# EAGLE design wx_station (EAGLE 4.16)
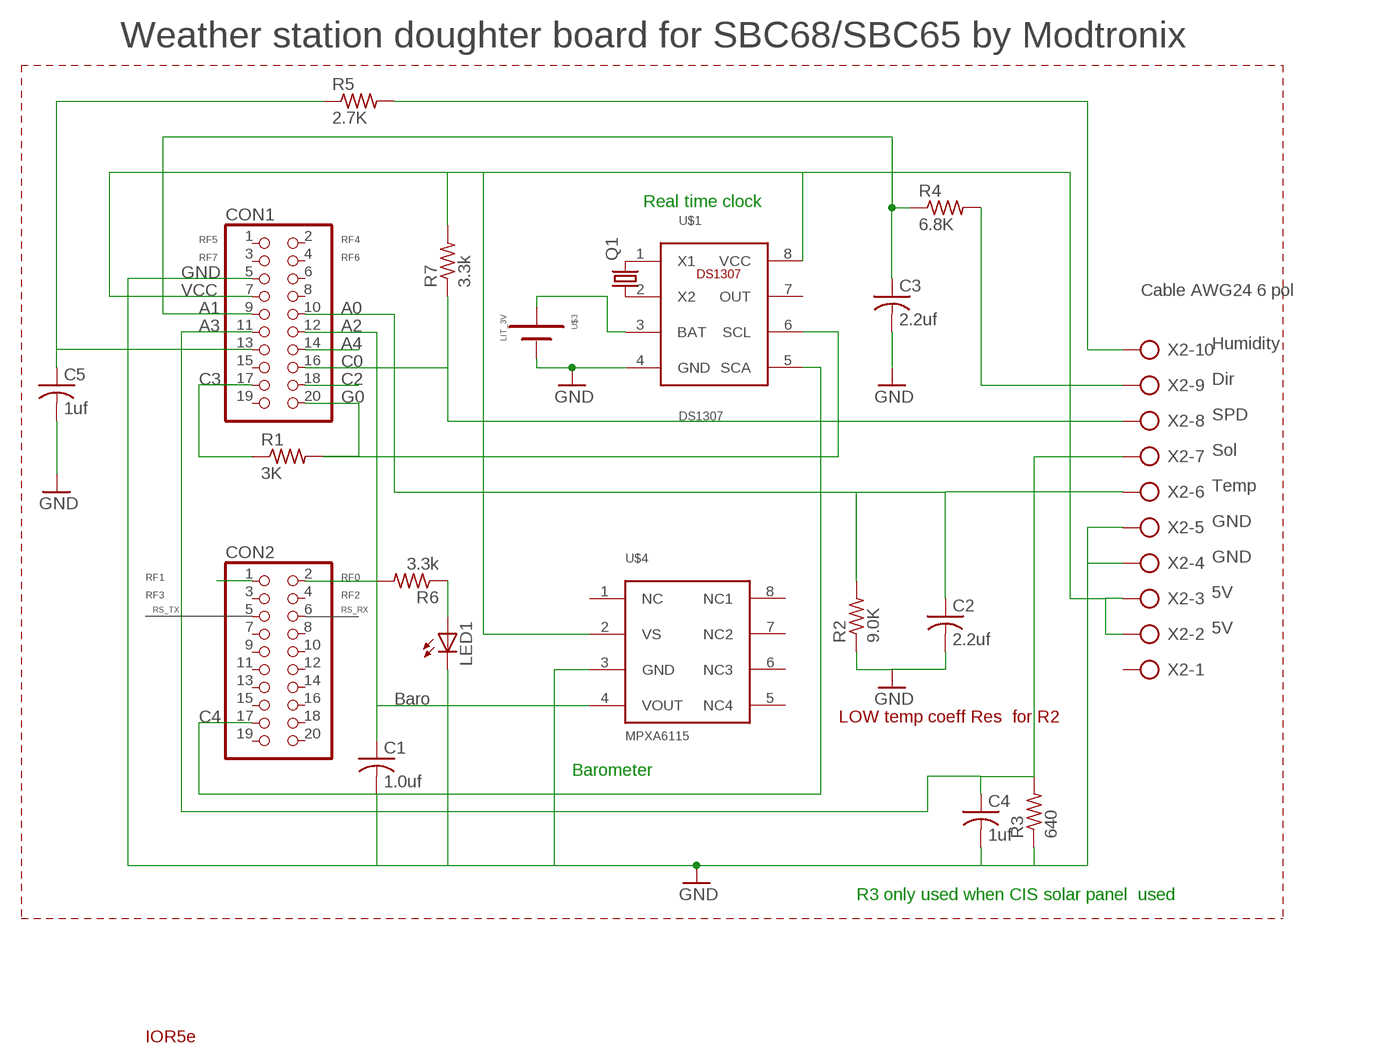
[diagram p0: schematic, sheet 1]

## Parts
C1  1.0uf  C-USC0805  [C0805]
C2  2.2uf  C-USC0805K  [C0805K]
C3  2.2uf  C-USC1206  [C1206]
C4  1uf  C-USC0805  [C0805]
C5  1uf  C-USC0805  [C0805]
CON1  PINHD-2X10  [2X10]
CON2  PINHD-2X10  [2X10]
LED1  LED3MM  [LED3MM]
Q1  CRYSTALTC26H  [TC26H]
R1  3K  R-US_M0805  [M0805]
R2  9.0K  R-US_0207/10  [0207/10]
R3  640  R-US_0207/10  [0207/10]
R4  6.8K  R-US_0207/10  [0207/10]
R5  2.7K  R-US_0207/10  [0207/10]
R6  3.3k  R-US_0207/10  [0207/10]
R7  3.3k  R-US_0207/10  [0207/10]
U$1  DS1307  [DIL08]
U$3  LIT_3V  [BATTERY2]
U$4  MPXA6115  [SO08]
U$7  IOR5E  [IOR5E]
X2  AK500/10  [AK500/10]

## Nets
BARO_OUT: C1.1 CON1.12 U$4.4(VOUT)
BAT: U$1.3(BAT) U$3.PLUS
GND: C1.2 C2.2 C3.2 C4.2 C5.2 CON1.5 LED1.K(C) R2.1 R3.1 U$1.4(GND) U$3.MINUS U$4.3(GND) X2.4 X2.5
N$1: Q1.2 U$1.1(X1)
N$2: Q1.1 U$1.2(X2)
N$3: CON1.17 R1.1
N$4: CON1.20 R1.2 U$1.6(SCL)
N$5: CON2.17 U$1.5(SCA)
N$6: C5.1 CON1.13 R5.1
N$8: CON2.2 R6.2
N$11: C3.1 CON1.9 R4.1
N$15: CON1.14
N$17: LED1.A R6.1
N$18: CON1.18
PIN_1_2: CON2.1
SIG_DIR: R4.2 X2.9
SIG_HUMIDITY: R5.2 X2.10
SIG_SOL: C4.1 CON1.11 R3.2 X2.7
SIG_SPD: CON1.16 R7.1 X2.8
SIG_TEMP: C2.1 CON1.10 R2.2 X2.6
VCC: CON1.7 R7.2 U$1.8(VCC) U$4.2(VS) X2.2 X2.3
Unconnected: CON1.1 CON1.2 CON1.3 CON1.4 CON1.6 CON1.8 CON1.15 CON1.19 CON2.3 CON2.4 CON2.5 CON2.6 CON2.7 CON2.8 CON2.9 CON2.10 CON2.11 CON2.12 CON2.13 CON2.14 CON2.15 CON2.16 CON2.18 CON2.19 CON2.20 U$1.7(OUT) U$4.1(NC) U$4.5(NC4) U$4.6(NC3) U$4.7(NC2) U$4.8(NC1) X2.1

## Notes on the sheet
- Weather station doughter board for SBC68/SBC65 by Modtronix
- Real time clock
- RF5 | RF4
- RF7 | RF6
- GND
- VCC | Cable AWG24 6 pol
- A1 | A0
- A3 | A2
- A4 | Humidity
- C0
- C3 | C2 | Dir
- G0
- SPD
- Sol
- Temp
- GND
- GND
- RF1 | RF0
- RF3 | RF2 | 5V
- RS_TX | RS_RX
- 5V
- Baro
- C4 | LOW temp coeff Res  for R2
- Barometer
- R3 only used when CIS solar panel  used

## Library data of the parts
C1-C5 = rcl:C-US: CAPACITOR, American symbol
CON1 CON2 = pinhead:PINHD-2X10: PIN HEADER
LED1 = led:LED: LED OSRAM: - CHIPLED LG R971, LG N971, LY N971, LG Q971, LY Q971, LO R971, LY R971 LH N974, LH R974 LS Q976, LO Q976, LY Q976 LO Q996 - Hyper CHIPLED LW Q18S LB Q993, LB Q99A, LB R99A - SideLED LS A670, LO A670, LY A670, LG A670, LP A670 LB A673, LV A673, LT A673, LW A673 LH A674 LY A675 LS A676, LA A676, LO A676, LY A676, LW A676 LS A679, LY A679, LG A679 - Hyper Micro SIDELED® LS Y876, LA Y876, LO Y876, LY Y876 LT Y87S - SmartLED LW L88C, LW L88S LB L89C, LB L89S, LG L890 LS L89K, LO L89K, LY L89K LS L896, LA L896, LO L896, LY L896 - TOPLED LS T670, LO T670, LY T670, LG T670, LP T670 LSG T670, LSP T670, LSY T670, LOP T670, LYG T670 LG T671, LOG T671, LSG T671 LB T673, LV T673, LT T673, LW T673 LH T674 LS T676, LA T676, LO T676, LY T676, LB T676, LH T676, LSB T676, LW T676 LB T67C, LV T67C, LT T67C, LS T67K, LO T67K, LY T67K, LW E67C LS E67B, LA E67B, LO E67B, LY E67B, LB E67C, LV E67C, LT E67C LW T67C LS T679, LY T679, LG T679 LS T770, LO T770, LY T770, LG T770, LP T770 LB T773, LV T773, LT T773, LW T773 LH T774 LS E675, LA E675, LY E675, LS T675 LS T776, LA T776, LO T776, LY T776, LB T776 LHGB T686 LT T68C, LB T68C - Hyper Mini TOPLED® LB M676 - Mini TOPLED Santana® LG M470 LS M47K, LO M47K, LY M47K Source: http://www.osram.convergy.de - LUMILED® LXK2-PW12-R00, LXK2-PW12-S00, LXK2-PW14-U00, LXK2-PW14-V00 LXK2-PM12-R00, LXK2-PM12-S00, LXK2-PM14-U00 LXK2-PE12-Q00, LXK2-PE12-R00, LXK2-PE12-S00, LXK2-PE14-T00, LXK2-PE14-U00 LXK2-PB12-K00, LXK2-PB12-L00, LXK2-PB12-M00, LXK2-PB14-N00, LXK2-PB14-P00, LXK2-PB14-Q00 LXK2-PR12-L00, LXK2-PR12-M00, LXK2-PR14-Q00, LXK2-PR14-R00 LXK2-PD12-Q00, LXK2-PD12-R00, LXK2-PD12-S00 LXK2-PH12-R00, LXK2-PH12-S00 LXK2-PL12-P00, LXK2-PL12-Q00, LXK2-PL12-R00 Source: www.luxeon.com
Q1 = crystal:CRYSTAL: CRYSTAL
R1-R7 = rcl:R-US_: RESISTOR, American symbol
U$1 = maxim:DS1307
U$3 = special:LIT_3V: Lithium 3V battery cell holder,2pin
U$4 = Stofer:MPXA6115
U$7 = PCB-Outlines:IOR5E
X2 = con-ptr500:AK500/10: CONNECTOR

## Board
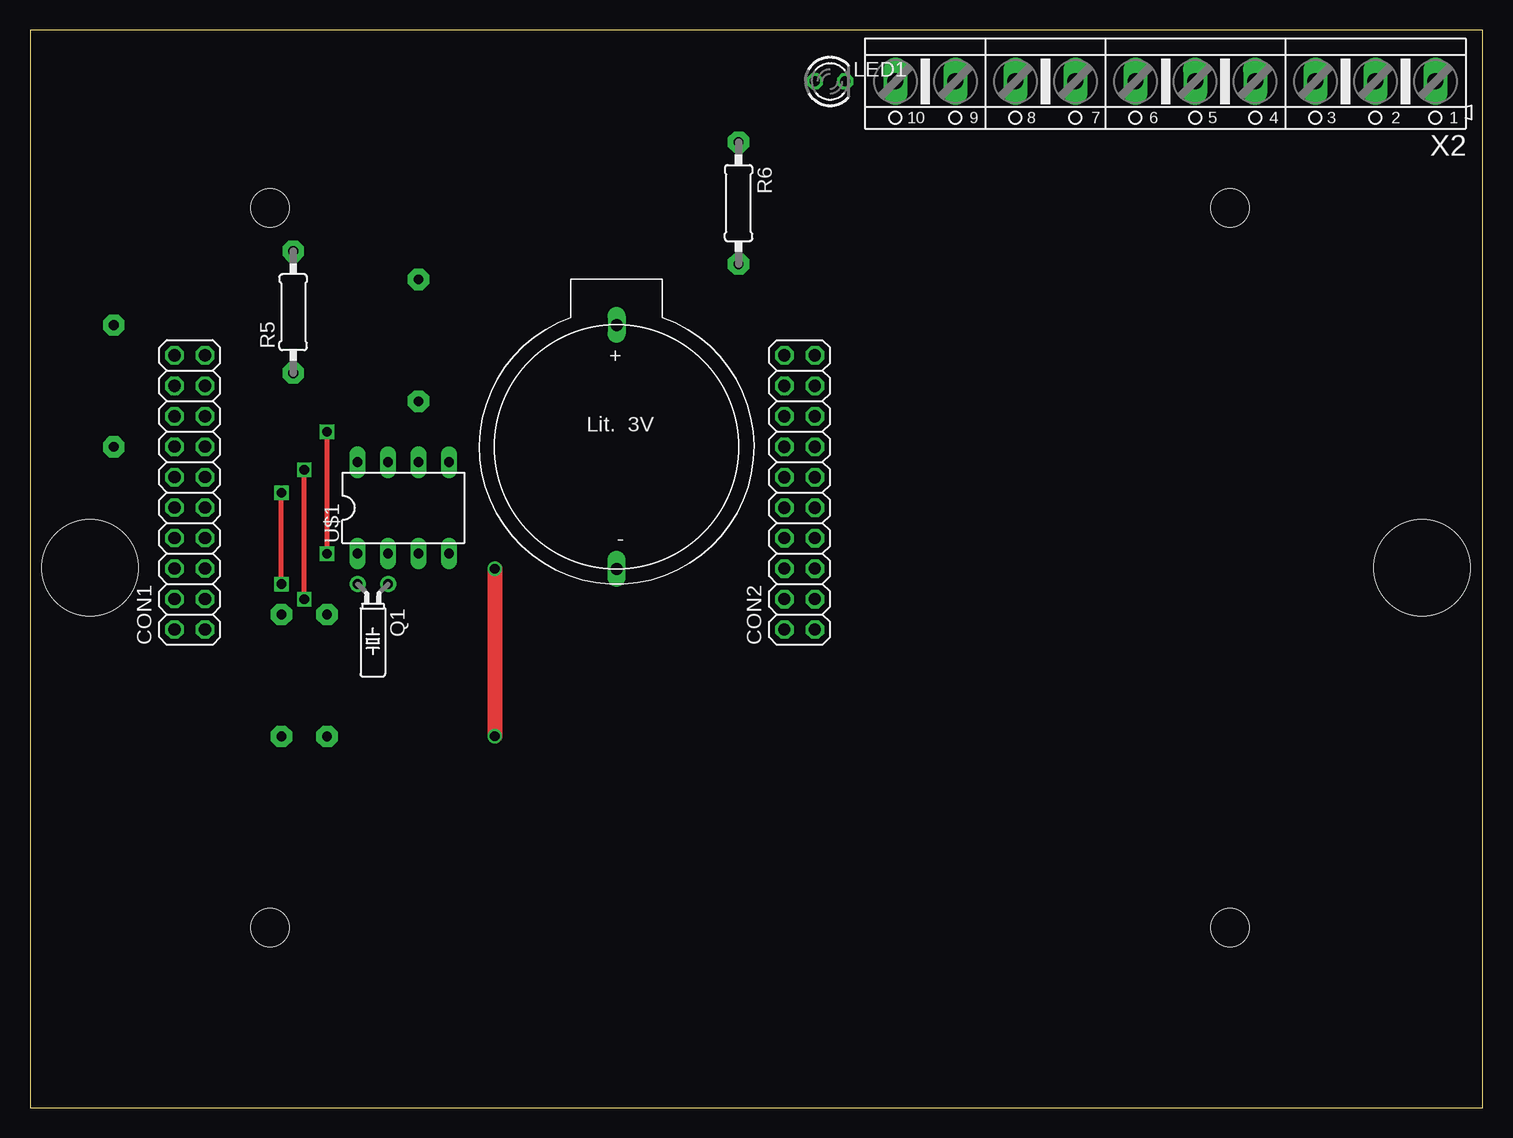
[diagram p1: board, top side]
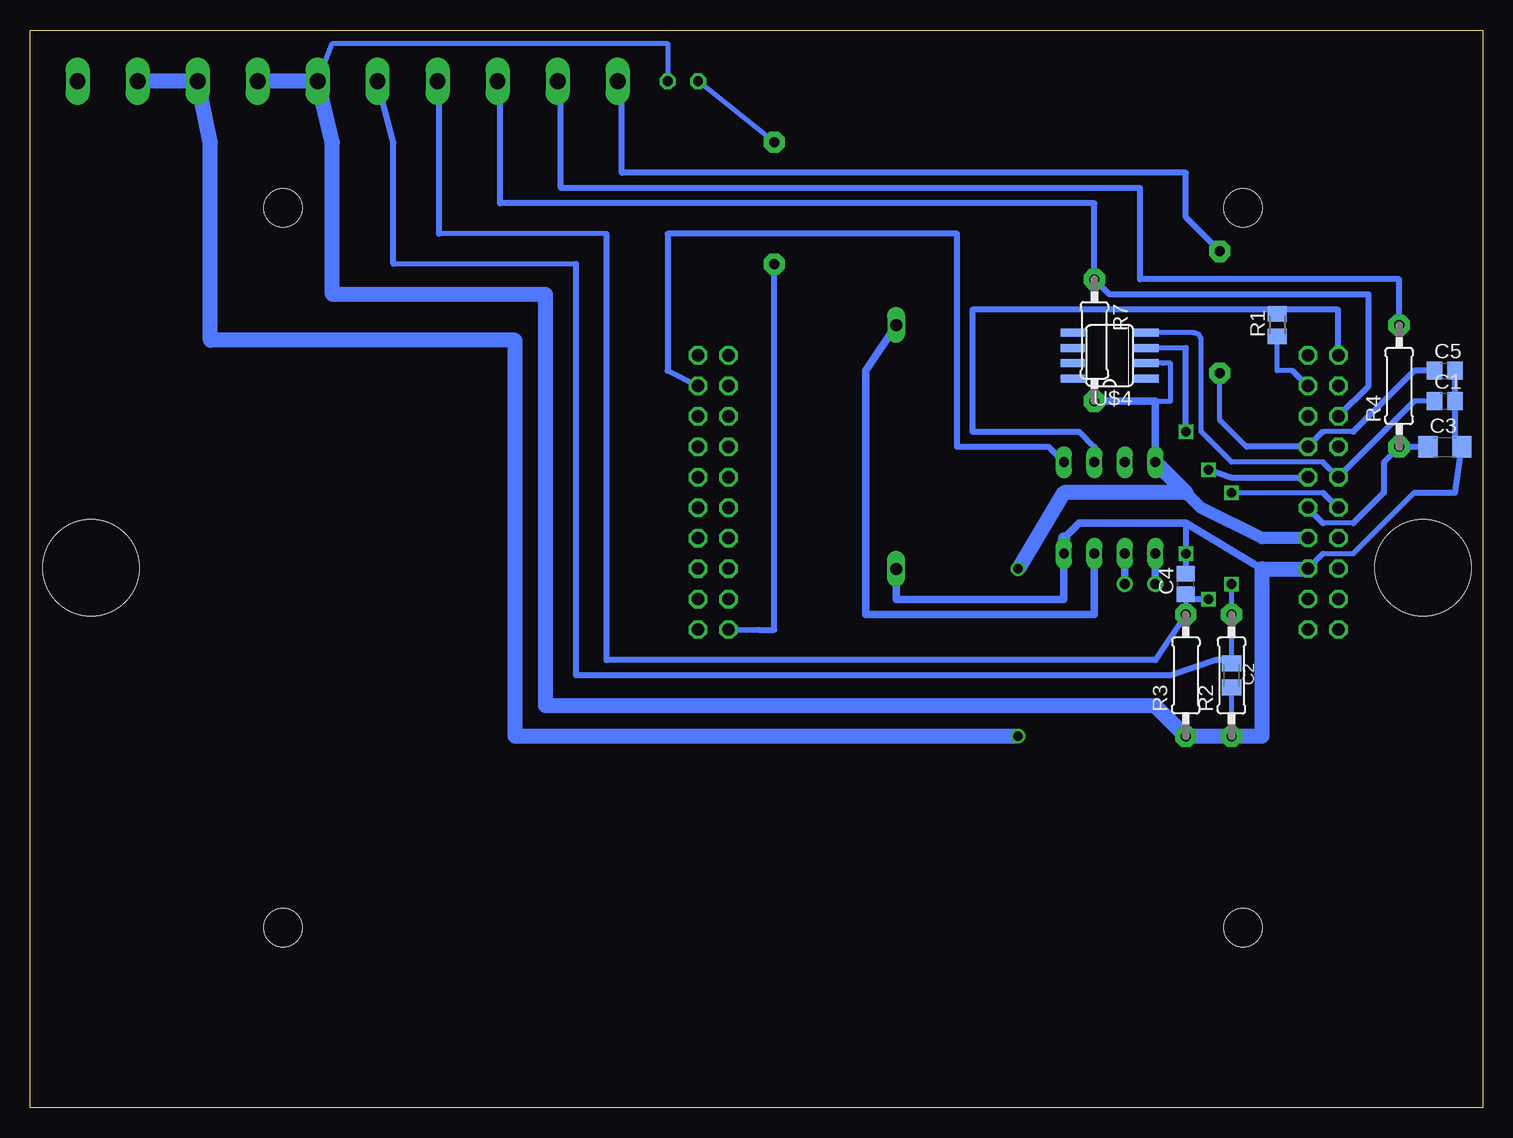
[diagram p2: board, bottom side, seen from below]

Size 121.08 x 89.86 mm. Coordinates in mm from the lower left corner, seen from the top.
Outline: 0,0.02 121.08,0 121.08,89.84 0,89.86 0,0.02
Copper layers (1*2+15*16): Top 0.035mm / dielectric 0.2mm / Route2 0.035mm / dielectric 0.15mm / Route15 0.035mm / dielectric 0.2mm / Bottom 0.035mm
Design rules "default": minimum track width 10mil, minimum drill 24mil, track to track 8mil, track to pad 8mil, pad to pad 8mil, via to via 8mil, smd to smd 8mil, copper to edge 40mil, drill to drill 8mil, minimum pad ring 10mil, minimum via ring 8mil, stop-mask expansion 4mil, vias tented up to drill 0mil, thermal gap 10mil

### Footprints (pad centres in the part's own frame; a part is rotated, then mirrored left to right if it is on the bottom)
C0805 = smd 1.3 x 1.5: 1 -0.85,0; 2 0.85,0
C0805K = smd 1.3 x 1.6: 1 -1,0; 2 1,0
C1206 = smd 1.6 x 1.8: 1 -1.4,0; 2 1.4,0
2X10 = drill 1.016 octagon: 1 -11.43,-1.27; 2 -11.43,1.27; 3 -8.89,-1.27; 4 -8.89,1.27; 5 -6.35,-1.27; 6 -6.35,1.27; 7 -3.81,-1.27; 8 -3.81,1.27; 9 -1.27,-1.27; 10 -1.27,1.27; 11 1.27,-1.27; 12 1.27,1.27; 13 3.81,-1.27; 14 3.81,1.27; 15 6.35,-1.27; 16 6.35,1.27; 17 8.89,-1.27; 18 8.89,1.27; 19 11.43,-1.27; 20 11.43,1.27
LED3MM = drill 0.813 octagon: A -1.27,0; K 1.27,0
TC26H = drill 0.813 round: 1 -1.27,0; 2 1.27,0
M0805 = smd 1.3 x 1.6: 1 -0.95,0; 2 0.95,0
0207/10 = drill 0.813 pad 1.778 octagon: 1 -5.08,0; 2 5.08,0
DIL08 = drill 0.813 long: 1 -3.81,-3.81; 2 -1.27,-3.81; 3 1.27,-3.81; 4 3.81,-3.81; 5 3.81,3.81; 6 1.27,3.81; 7 -1.27,3.81; 8 -3.81,3.81
BATTERY2 = drill 1 long: MINUS 0,-10.16; PLUS 0,10.16
SO08 = smd 0.66 x 2.032: 1 -1.905,-3.073; 2 -0.635,-3.073; 3 0.635,-3.073; 4 1.905,-3.073; 5 1.905,3.073; 6 0.635,3.073; 7 -0.635,3.073; 8 -1.905,3.073
IOR5E = hole 3.2: 20,15; 20,75; 100,15; 100,75 | hole 8: 5,45; 116,45
AK500/10 = drill 1.321 long: 1 -22.504,0; 2 -17.501,0; 3 -12.497,0; 4 -7.493,0; 5 -2.489,0; 6 2.489,0; 7 7.493,0; 8 12.497,0; 9 17.501,0; 10 22.504,0

### Placement (x,y rotation side)
C1  3.17,58.91 0 bottom
C2  20.95,36.05 270 bottom
C3  3.17,55.1 0 bottom
C4  24.76,43.67 90 bottom
C5  3.17,61.45 0 bottom
CON1  13.31,51.31 90 top
CON2  64.14,51.3 90 top
LED1  66.67,85.58 0 top
Q1  28.57,43.67 180 top
R1  17.14,65.26 90 bottom
R2  20.95,36.05 90 bottom
R3  24.76,36.05 90 bottom
R4  6.98,60.18 90 bottom
R5  21.93,66.33 90 top
R6  59.05,75.42 270 top
R7  32.38,63.99 270 bottom
U$1  31.11,50.02 0 top
U$3  48.89,55.1 0 top
U$4  31.11,62.72 90 bottom
U$7  0,0.03 0 top
X2  94.61,85.58 180 top

### Tracks (layer width: path | path; a pad name or v marks a point on that pad's centre or on a via)
BARO_OUT
  Bottom 0.406: 13.33,53.83 20.95,53.83 23.49,56.37 23.49,63.99 arc-90 24.12,64.63 U$4.4 | C1.1 5.71,58.91 | CON1.12
  Bottom 0.508: CON1.12 13.33,53.83 | 5.71,58.91 CON1.12
BAT
  Bottom 0.61: U$1.3 32.38,41.13 51.43,41.13 51.43,61.45 U$3.PLUS
GND  (via drill 0.8)
  Top 0.406: v24.76,46.21 v24.76,56.37
  Bottom 0.406: 13.33,46.21 10.79,46.21 5.71,51.29 | 14.6,44.94 CON1.5 | R2.1 C2.2 | 24.76,63.36 U$4.3 | C3.2 1.9,55.1 arc90 2.32,55.52 | C1.2 1.9,58.91 | X2.5 95.88,88.76 67.94,88.76 LED1.K
  Bottom 0.508: 14.6,44.94 13.33,46.21 | 5.71,51.29 2.32,51.29 C3.2 | v24.76,56.37 24.76,63.36 | 24.76,48.75 v24.76,46.21 C4.2 | 2.32,55.52 C1.2 C5.2
  Bottom 0.61: 34.92,47.48 33.65,48.75 24.76,48.75 18.41,44.94 | U$1.4 34.92,42.4 48.89,42.4 U$3.MINUS
  Bottom 1.016: 34.92,47.48 U$1.4
  Bottom 1.27: 14.6,44.94 18.41,44.94 18.41,30.97 R2.1 R3.1 27.3,33.51 78.1,33.51 78.1,67.8 95.88,67.8 95.88,80.5 X2.5 X2.4
N$1
  Bottom 0.61: Q1.2 U$1.1
N$2
  Bottom 0.61: Q1.1 U$1.2
N$3
  Bottom 0.406: R1.1 17.14,61.45 15.87,61.45 | 14.6,60.18 CON1.17
  Bottom 0.508: 14.6,60.18 15.87,61.45
N$4
  Bottom 0.406: 12.06,62.72 CON1.20 | 17.14,66.53 R1.2
  Bottom 0.508: U$1.6 32.38,55.1 33.65,56.37 42.54,56.37 42.54,66.53 17.14,66.53 12.06,66.53 12.06,62.72
N$5
  Bottom 0.406: CON2.17
  Bottom 0.508: CON2.17 67.94,61.45 67.94,72.88 43.81,72.88 43.81,55.1 36.19,55.1 U$1.5
N$6
  Bottom 0.406: CON1.13 | 10.79,56.37 13.33,56.37 | 5.71,61.45 4.44,61.45 | 19.68,55.12 19.68,55.1 21.93,57.35 R5.1
  Bottom 0.508: 13.33,56.37 CON1.13 | 10.79,56.37 5.71,61.45 C5.1 | CON1.13 19.68,55.12
N$8
  Bottom 0.508: CON2.2 60.32,39.86 59.05,39.86 R6.2
N$9  (via drill 1.3)
  other vias: 4.99,45.04
N$10  (via drill 1.3)
  other vias: 116,45.04
N$11
  Bottom 0.406: 14.58,50 CON1.9 | 10.79,48.75 13.33,48.75
  Bottom 0.508: 13.33,48.75 14.58,50 | 10.79,48.75 8.25,51.29 8.25,53.83 R4.1 C3.1
N$12  (via drill 1.3)
  other vias: 100.01,75.02
N$13  (via drill 1.3)
  other vias: 100,15.02
N$14  (via drill 1.3)
  other vias: 20,15.04
N$16  (via drill 1.3)
  other vias: 20,75.03
N$17
  Bottom 0.406: R6.1 LED1.A
SIG_DIR
  Bottom 0.508: R4.2 6.98,69.07 28.57,69.07 28.57,76.69 76.83,76.69 76.83,85.58 X2.9
SIG_HUMIDITY
  Bottom 0.508: R5.2 24.76,74.24 24.76,77.96 71.75,77.96 71.75,85.58 X2.10
SIG_SOL  (via drill 0.8)
  Top 0.406: v22.86,42.4 v22.86,53.2
  Bottom 0.406: 14.6,52.56 CON1.11 | 73.02,72.88 86.99,72.88 | C4.1 24.76,42.4 R3.2
  Bottom 0.508: v22.86,53.2 20.95,52.56 14.6,52.56 | 73.02,72.88 73.02,37.32 27.3,37.32 R3.2 | v22.86,42.4 24.76,42.4 | X2.7 86.99,85.58 86.99,72.88
SIG_SPD
  Bottom 0.406: 12.06,57.64 CON1.16
  Bottom 0.508: CON1.16 9.52,60.18 9.52,67.8 31.11,67.8 R7.1 32.38,75.42 81.91,75.42 81.91,85.58 X2.8
SIG_TEMP  (via drill 0.8)
  Top 0.406: v20.95,43.67 v20.95,51.29
  Bottom 0.406: 12.08,50.04 CON1.10 | v20.95,51.29 13.33,51.29 | 75.56,70.34 90.8,70.34 | v20.95,43.67 R2.2 20.95,37.32 C2.1
  Bottom 0.508: 13.33,51.29 12.08,50.04 | 75.56,70.34 75.56,36.05 26.03,36.05 22.22,37.32 20.95,37.32 | 90.8,70.34 90.8,80.5 X2.6
VCC  (via drill 0.8 pad 1.02)
  Top 1.27: v38.73,44.94 v38.73,30.97
  Bottom 0.406: CON1.7 14.6,47.48 14.62,47.5 | U$4.2 26.66,62.09 26.66,62.08 26.03,62.08 26.03,62.01 26.03,58.91 27.3,58.91
  Bottom 0.61: R7.2 27.3,58.91 U$1.8
  Bottom 1.016: 14.62,47.5 18.43,47.5 23.49,50.02 U$1.8
  Bottom 1.27: X2.2 X2.3 106.04,80.5 106.04,63.99 80.64,63.99 80.64,30.97 v38.73,30.97 | v38.73,44.94 34.92,51.29 24.76,51.29 U$1.8